# EAGLE design interstage_A2 (EAGLE 9.6.0)
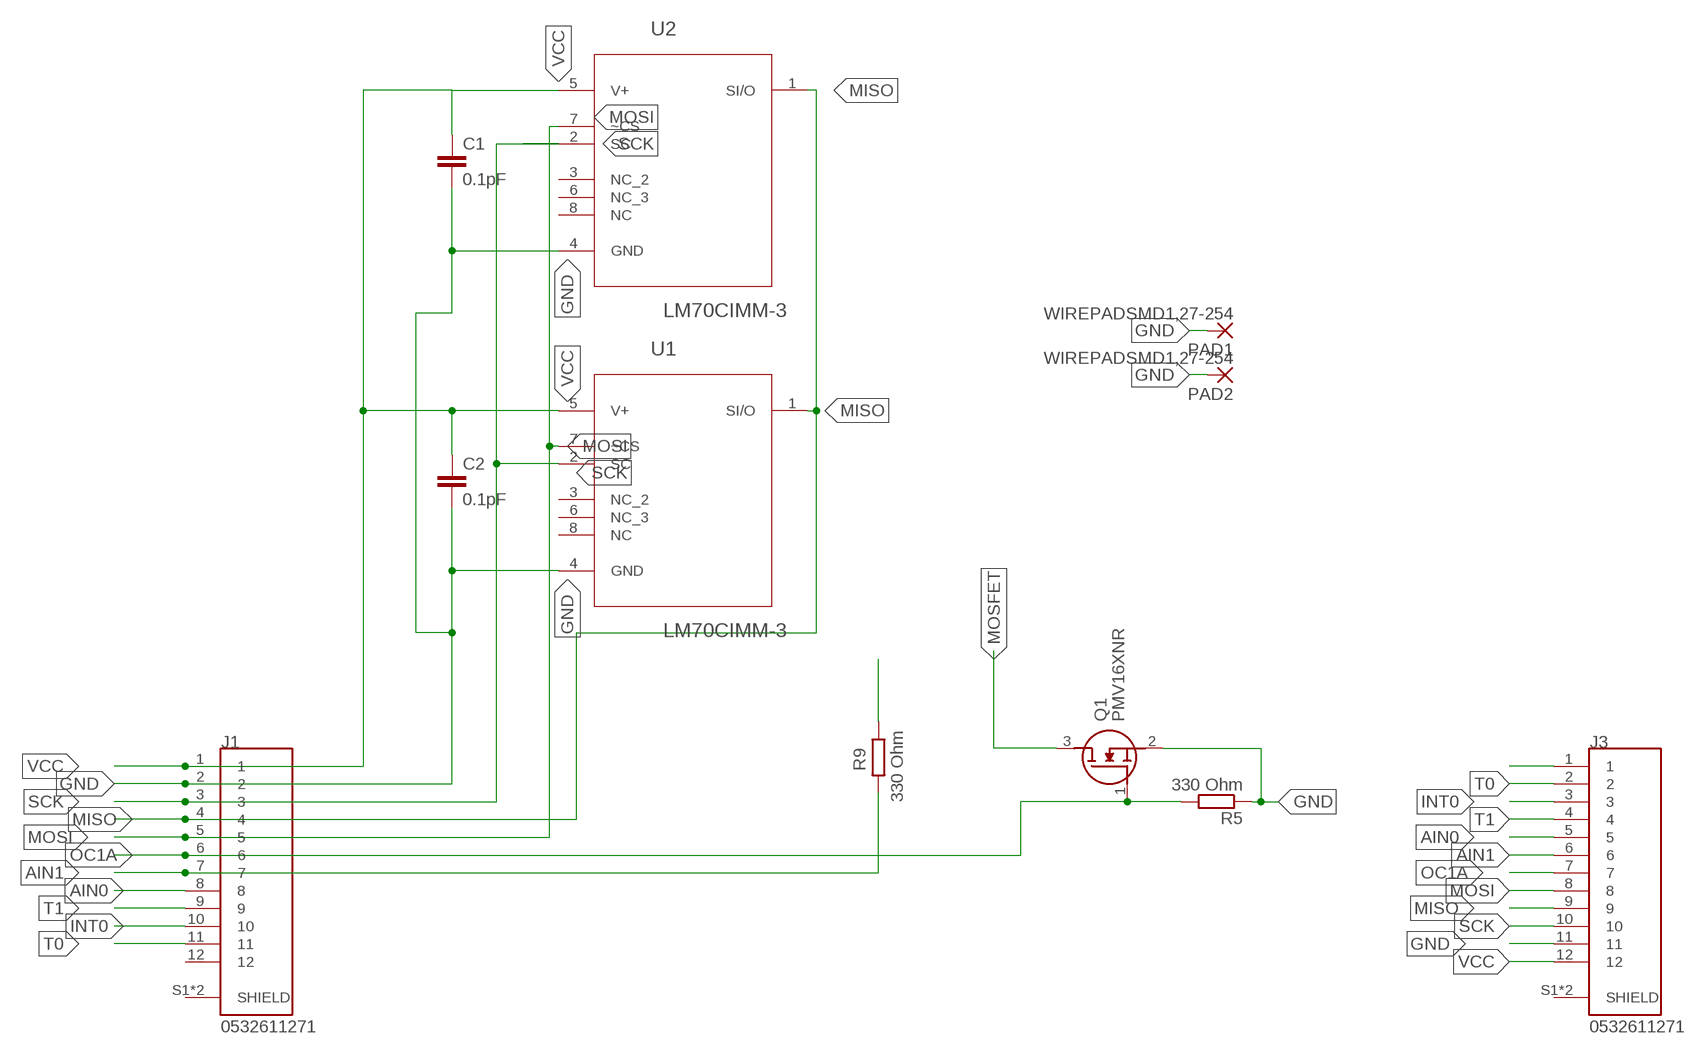
[diagram p0: schematic, sheet 1]

## Parts
C1  0.1pF  C-EUC0603K  [C0603K]
C2  0.1pF  C-EUC0603K  [C0603K]
J1  0532611271  [MOLEX_0532611271]
J3  0532611271  [MOLEX_0532611271]
PAD1  WIREPADSMD1,27-254  [SMD1,27-2,54]
PAD2  WIREPADSMD1,27-254  [SMD1,27-2,54]
Q1  PMV16XNR  [SOT95P230X110-3N]
R5  330 Ohm  R-EU_R1206  [R1206]
R9  330 Ohm  R-EU_R1206  [R1206]
U1  LM70CIMM-3  [SOP65P490X110-8N]
U2  LM70CIMM-3  [SOP65P490X110-8N]

## Nets
AIN0: J1.8 J3.5
AIN1: J1.7 J3.6 R9.2
GND: C1.2 C2.2 J1.2 J3.11 PAD1.1(P) PAD2.1(P) Q1.2(S) R5.1 U1.4(GND) U2.4(GND)
INT0: J1.10 J3.3
MISO: J1.4 J3.9 U1.1(SI/O) U2.1(SI/O)
MOSFET: Q1.3(D)
MOSI: J1.5 J3.8 U1.7(~CS) U2.7(~CS)
N$3: J3.1
N$4: R9.1
OC1A: J1.6 J3.7 Q1.1(G) R5.2
SCK: J1.3 J3.10 U1.2(SC) U2.2(SC)
T0: J1.11 J3.2
T1: J1.9 J3.4
VCC: C1.1 C2.1 J1.1 J3.12 U1.5(V+) U2.5(V+)
Unconnected: J1.12 J1.S1(SHIELD) J1.S2(SHIELD) J3.S1(SHIELD) J3.S2(SHIELD) U1.3(NC_2) U1.6(NC_3) U1.8(NC) U2.3(NC_2) U2.6(NC_3) U2.8(NC)

## Library data of the parts
C1 C2 = rcl:C-EU: CAPACITOR, European symbol; SPICEPREFIX: C
J1 J3 = picoblade:0532611271: Conn Shrouded Header HDR 12 POS 1.25mm Solder RA SMD PicoBlade; AVAILABILITY: Unavailable; DESCRIPTION: Picoblade Connector, 12 Circuit Single Row, Right Angle Surface Mount SMT PCB; MF: Molex; MP: 0532611271; PACKAGE: None; PRICE: None
PAD1 PAD2 = wirepad:WIREPAD: Wire PAD connect wire on PCB
Q1 = SamacSys_Parts:PMV16XNR: Nexperia PMV16XNR N-channel MOSFET, 8.6 A, 20 V PMV16XN, 3-Pin SOT-23 Source: Datasheet <https://componentsearchengine.com/Datasheets/1/PMV16XNR.pdf>; DESCRIPTION: Nexperia PMV16XNR N-channel MOSFET, 8.6 A, 20 V PMV16XN, 3-Pin SOT-23; HEIGHT: 1.1mm; MANUFACTURER_NAME: Nexperia; MANUFACTURER_PART_NUMBER: PMV16XNR; MOUSER_PART_NUMBER: 771-PMV16XNR; MOUSER_PRICE-STOCK: https://www.mouser.com/Search/Refine.aspx?Keyword=771-PMV16XNR
R5 R9 = rcl:R-EU_: RESISTOR, European symbol; SPICEPREFIX: R
U1 U2 = LM70CIMM-3:LM70CIMM-3: 10-Bit plus Sign Digital Temperature Sensor; AVAILABILITY: Unavailable; DESCRIPTION: Temperature Sensor Digital, Local -55°C ~ 150°C 10 b 8-VSSOP; MF: Texas Instruments; MP: LM70CIMM-3/NOPB; PACKAGE: MSOP-8 Texas Instruments; PRICE: None

## Board
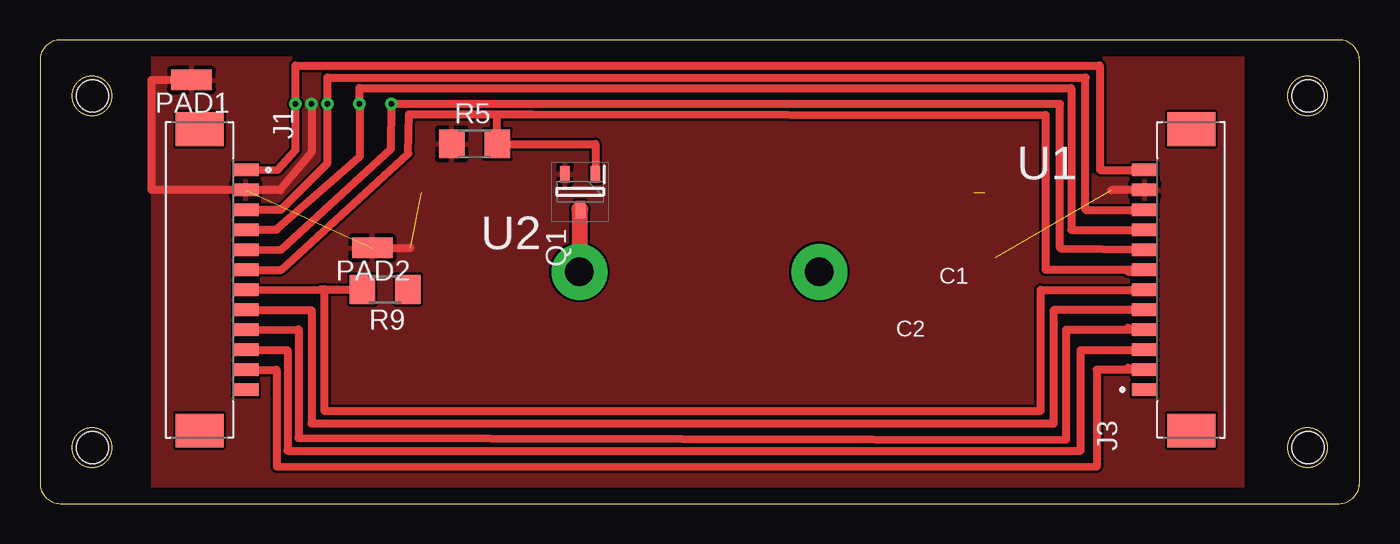
[diagram p1: board, top side]
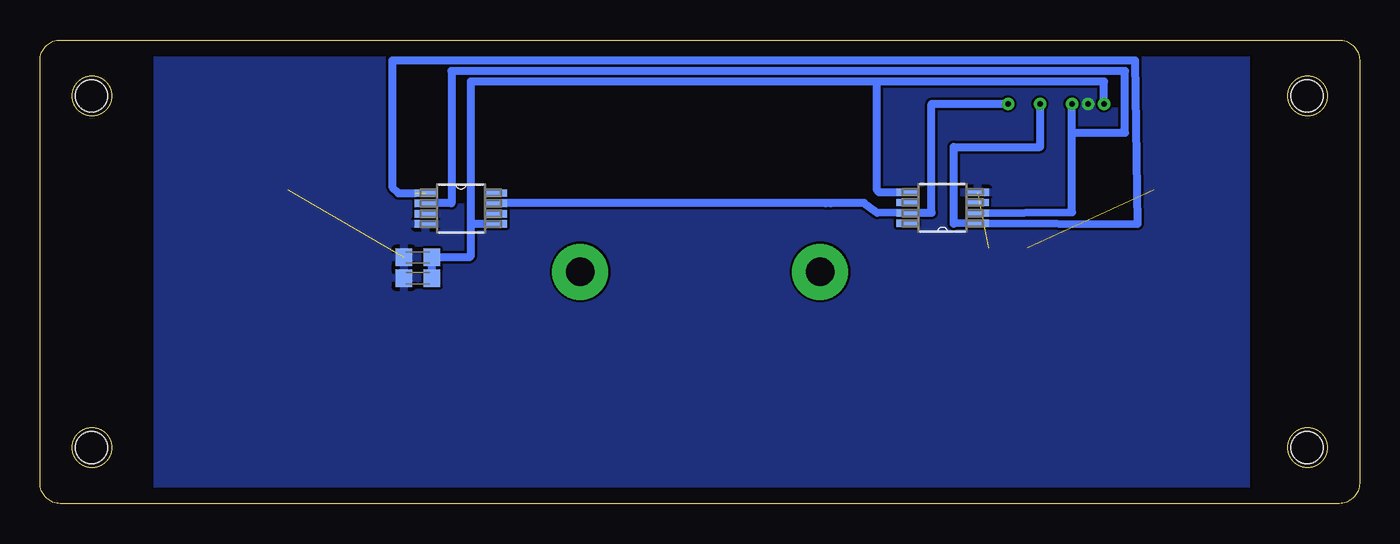
[diagram p2: board, bottom side, seen from below]

Size 82.5 x 29 mm. Coordinates in mm from the lower left corner, seen from the top.
Outline: 0,1.27 arc90 1.27,0 81.23,0 arc90 82.5,1.27 82.5,27.73 arc90 81.23,29 1.27,29 arc90 0,27.73 0,1.27
Outline: circle at 79.25,3.5 radius 1.25
Outline: circle at 3.25,25.5 radius 1.25
Outline: circle at 3.25,3.5 radius 1.25
Outline: circle at 79.25,25.5 radius 1.25
Copper layers (1*16): Top 0.035mm / dielectric 1.5mm / Bottom 0.035mm
Design rules "default": minimum track width 6mil, minimum drill 0.35mm, track to track 6mil, track to pad 6mil, pad to pad 6mil, via to via 6mil, smd to smd 6mil, copper to edge 40mil, drill to drill 6mil, minimum pad ring 10mil, minimum via ring 8mil, stop-mask expansion 4mil, vias tented up to drill 0mil, thermal gap 10mil
Holes 2 mm at 3.27,3.5 3.27,25.5 79.27,25.5 79.27,3.5

### Footprints (pad centres in the part's own frame; a part is rotated, then mirrored left to right if it is on the bottom)
C0603K = smd 1.05 x 1.08: 1 -0.875,0; 2 0.875,0
MOLEX_0532611271 = smd 0.8 x 1.6: 1 -6.875,2.9; 2 -5.625,2.9; 3 -4.375,2.9; 4 -3.125,2.9; 5 -1.875,2.9; 6 -0.625,2.9; 7 0.625,2.9; 8 1.875,2.9; 9 3.125,2.9; 10 4.375,2.9; 11 5.625,2.9; 12 6.875,2.9 | smd 2.1 x 3: S1 -9.425,0; S2 9.425,0
SMD1,27-2,54 = smd 1.27 x 2.54: 1 0,0
SOT95P230X110-3N = smd 1.05 x 0.6: 1 -1.1,0.95; 2 -1.1,-0.95; 3 1.1,0
R1206 = smd 1.6 x 1.803: 1 -1.422,0; 2 1.422,0
SOP65P490X110-8N = smd 1.372 x 0.457: 1 -2.21,0.965; 2 -2.21,0.33; 3 -2.21,-0.33; 4 -2.21,-0.965; 5 2.21,-0.965; 6 2.21,-0.33; 7 2.21,0.33; 8 2.21,0.965

### Placement (x,y rotation side)
C1  58.87,15.4 180 bottom
C2  58.87,14.1 180 bottom
J1  9.97,14 270 top
J3  71.97,14 90 top
PAD1  9.47,26.5 90 top
PAD2  20.77,16 90 top
Q1  33.77,19.5 270 top
R5  27.17,22.5 0 top
R9  21.57,13.4 180 top
U1  56.18,18.46 0 bottom
U2  26.07,18.5 180 bottom

### Tracks (layer width: path | path; a pad name or v marks a point on that pad's centre or on a via)
AIN0
  Top 0.5: J1.8 16.97,12.1 16.97,5 63.37,5 63.37,12.1 J3.5
AIN1
  Top 0.5: J3.6 62.57,13.38 62.57,5.8 17.77,5.8 17.77,13.39 | J1.7 17.57,13.39 17.77,13.39 | 17.77,13.39 R9.2
GND  (via drill 0.35)  (3 unrouted)
  Top 0.5: PAD1.1 6.97,26.5 6.97,19.62 J1.2 11.97,19.62 15.02,19.61 16.97,21.97 v16.97,25 | J3.11 66.97,19.6 | PAD2.1 23.17,16
  pour Top: 7.07,28 7.07,0.5 75.17,0.5 75.17,28
  pour Bottom: 7.07,28 75.17,28 75.17,0.5 7.07,0.5
INT0
  Top 0.5: J1.10 15.47,9.6 15.47,3.3 65.07,3.3 65.07,9.6 J3.3
MISO  (via drill 0.35)  (1 unrouted)
  Top 0.5: J3.9 64.47,17.12 64.47,26 19.97,26 v19.97,25 19.97,21.68 14.87,17.21 14.78,17.12 J1.4
  Bottom 0.5: 59.07,19.42 60.09,19.42 60.47,19.8 60.47,27.7 14.03,27.7 13.87,17.5 U2.1 25.37,17.5 25.37,22.3 19.97,22.3 v19.97,25
MOSFET  (via drill 1.8 pad 3.5)
  Top 1: Q1.3 33.72,18.4 v33.72,14.5
MOSI  (via drill 0.35)
  Top 0.5: J3.8 63.87,15.92 63.77,16.01 63.77,25 v21.97,25 21.94,22.2 15.07,15.88 J1.5
  Bottom 0.5: U1.7 33.37,18.79 | 33.06,18.79 33.37,18.79 | 33.37,18.79 30.97,18.8 30.17,18.2 U2.7 28.25,18.2 26.77,18.2 26.76,25 v21.97,25
N$2  (via drill 1.8 pad 3.5)
  other vias: 48.72,14.5
OC1A
  Top 0.5: 68.05,14.5 J3.7 62.87,14.62 62.87,24.3 30.77,24.34 | 30.77,24.34 30.77,24.35 28.57,24.35 | 28.57,24.35 23.07,24.35 23.02,21.89 15.07,14.62 J1.6 | 30.17,24.35 29.27,24.35 30.77,24.34 | 28.57,24.35 R5.2 34.72,22.5 Q1.1
SCK  (via drill 0.35)
  Top 0.5: J3.10 65.37,18.38 65.37,26.65 17.97,26.65 v17.97,25 | v17.97,25 17.97,21.3 15.17,18.49 15.06,18.38 J1.3 | v17.97,25
  Bottom 0.5: 58.42,18.76 U1.2 56.77,18.79 56.77,27.05 14.67,27.05 14.67,23.2 17.97,23.2 | U2.2 17.97,18.22 17.97,23.2 | 17.97,23.2 v17.97,25
T0
  Top 0.5: 68.05,8.5 J3.2 66.07,8.38 66.07,2.3 14.8,2.32 14.79,8.38 J1.11
T1
  Top 0.5: 68.05,11 J3.4 64.17,10.88 64.17,4 16.17,4.1 16.17,10.9 J1.9
VCC  (via drill 0.35)
  Top 0.5: J3.12 66.27,20.88 66.25,27.41 15.97,27.41 v15.97,25 15.97,22.1 14.89,20.89 J1.1
  Bottom 0.5: 30.07,26.4 15.97,26.4 v15.97,25 | 30.07,26.4 55.57,26.4 55.57,17.5 | U1.5 55.57,17.5 | U2.5 30.04,19.46 30.17,19.6 30.17,26.3 30.07,26.4 | C2.1 C1.1 55.67,15.4 55.57,15.5 55.57,17.5